# Altium schematic sheet control.SchDoc
size A4; SheetNumber: 1; SheetTotal: 3
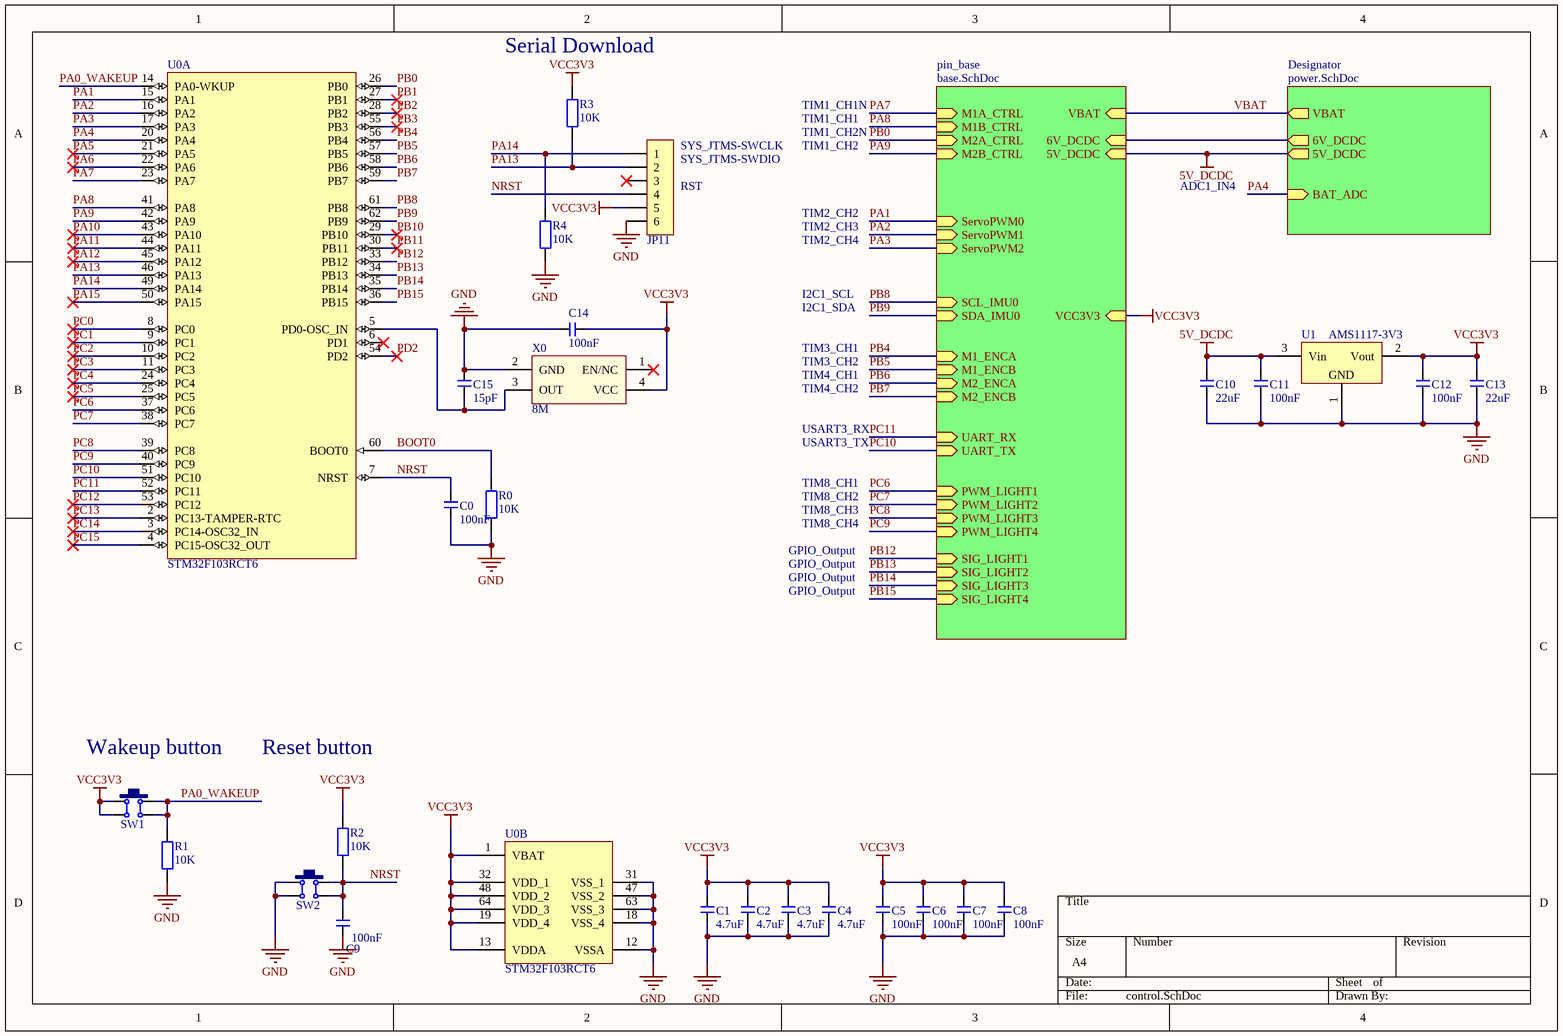
[diagram p0: control.SchDoc]

## Parts
C0  100nF  [C 0402_M]
C1  4.7uF  [C 0603_M]
C2  4.7uF  [C 0603_M]
C3  4.7uF  [C 0603_M]
C4  4.7uF  [C 0603_M]
C5  100nF  [C 0402_M]
C6  100nF  [C 0402_M]
C7  100nF  [C 0402_M]
C8  100nF  [C 0402_M]
C9  100nF  [C 0402_M]
C10  22uF  [C 1206_M]
C11  100nF  [C 0402_M]
C12  100nF  [C 0402_M]
C13  22uF  [C 1206_M]
C14  100nF  [C 0402_M]
C15  15pF  [C 0402_M]
JP11  HDR-1X6  [HDR2.54-WI-6P]  (value not drawn)
R0  10K  [R 0402_M]
R1  10K  [R 0402_M]
R2  10K  [R 0402_M]
R3  10K  [R 0402_M]
R4  10K  [R 0402_M]
SW1  6x6x5  [TSW SMD-6*6*4.3]  (value not drawn)
SW2  6x6x5  [TSW SMD-6*6*4.3]  (value not drawn)
U0  STM32F103RCT6  [LQFP64_M]  (parts A,B of 2)
U1  AMS1117-3V3  [SOT223_L]
X0  8M  [OSC 3225-4P]

## Sub-sheets
Designator = power.SchDoc: VBAT (out), 6V_DCDC (out), 5V_DCDC (out), BAT_ADC (in)
pin_base = base.SchDoc: M2B_CTRL (in), M2A_CTRL (in), M1B_CTRL (in), M1A_CTRL (in), VBAT (in), ServoPWM0 (in), ServoPWM1 (in), ServoPWM2 (in), SCL_IMU0 (in), SDA_IMU0 (in), M1_ENCB (in), M1_ENCA (in), M2_ENCA (in), M2_ENCB (in), 6V_DCDC (in), VCC3V3 (in), 5V_DCDC (in), UART_RX (in), UART_TX (in), PWM_LIGHT1 (in), PWM_LIGHT2 (in), PWM_LIGHT3 (in), PWM_LIGHT4 (in), SIG_LIGHT1 (in), SIG_LIGHT2 (in), SIG_LIGHT3 (in), SIG_LIGHT4 (in)

## Nets
5V_DCDC: C10.2 C11.2 U1.3(Vin) ; sheet pin_base/5V_DCDC, sheet Designator/5V_DCDC
GND: C0.1 C1.1 C2.1 C3.1 C4.1 C5.1 C6.1 C7.1 C8.1 C9.1 C10.1 C11.1 C12.1 C13.1 C14.2 C15.1 JP11.6 R0.1 R1.1 R4.1 SW2.1 SW2.4 U0.12(VSSA) U0.18(VSS_4) U0.31(VSS_1) U0.47(VSS_2) U0.63(VSS_3) U1.1(GND) X0.2(GND)
VCC3V3: C1.2 C2.2 C3.2 C4.2 C5.2 C6.2 C7.2 C8.2 C12.2 C13.2 C14.1 JP11.5 R2.2 R3.2 SW1.1 SW1.4 U0.1(VBAT) U0.13(VDDA) U0.19(VDD_4) U0.32(VDD_1) U0.48(VDD_2) U0.64(VDD_3) U1.2(Vout) X0.4(VCC) ; sheet pin_base/VCC3V3
BOOT0: R0.2 U0.60(BOOT0)
NRST: C0.2 C9.2 JP11.4 R2.1 SW2.2 SW2.3 U0.7(NRST)
PA0_WAKEUP: R1.2 SW1.2 SW1.3 U0.14(PA0-WKUP)
PA1: U0.15(PA1) ; sheet pin_base/ServoPWM0
PA2: U0.16(PA2) ; sheet pin_base/ServoPWM1
PA3: U0.17(PA3) ; sheet pin_base/ServoPWM2
PA4: U0.20(PA4) ; sheet Designator/BAT_ADC
PA5: U0.21(PA5)
PA6: U0.22(PA6)
PA7: U0.23(PA7) ; sheet pin_base/M1A_CTRL
PA8: U0.41(PA8) ; sheet pin_base/M1B_CTRL
PA9: U0.42(PA9) ; sheet pin_base/M2B_CTRL
PA10: U0.43(PA10)
PA11: U0.44(PA11)
PA12: U0.45(PA12)
PA13: JP11.2 R3.1 U0.46(PA13)
PA14: JP11.1 R4.2 U0.49(PA14)
PA15: U0.50(PA15)
PB0: U0.26(PB0) ; sheet pin_base/M2A_CTRL
PB1: U0.27(PB1)
PB2: U0.28(PB2)
PB3: U0.55(PB3)
PB4: U0.56(PB4) ; sheet pin_base/M1_ENCA
PB5: U0.57(PB5) ; sheet pin_base/M1_ENCB
PB6: U0.58(PB6) ; sheet pin_base/M2_ENCA
PB7: U0.59(PB7) ; sheet pin_base/M2_ENCB
PB8: U0.61(PB8) ; sheet pin_base/SCL_IMU0
PB9: U0.62(PB9) ; sheet pin_base/SDA_IMU0
PB10: U0.29(PB10)
PB11: U0.30(PB11)
PB12: U0.33(PB12) ; sheet pin_base/SIG_LIGHT1
PB13: U0.34(PB13) ; sheet pin_base/SIG_LIGHT2
PB14: U0.35(PB14) ; sheet pin_base/SIG_LIGHT3
PB15: U0.36(PB15) ; sheet pin_base/SIG_LIGHT4
PC0: U0.8(PC0)
PC1: U0.9(PC1)
PC2: U0.10(PC2)
PC3: U0.11(PC3)
PC4: U0.24(PC4)
PC5: U0.25(PC5)
PC6: U0.37(PC6) ; sheet pin_base/PWM_LIGHT1
PC7: U0.38(PC7) ; sheet pin_base/PWM_LIGHT2
PC8: U0.39(PC8) ; sheet pin_base/PWM_LIGHT3
PC9: U0.40(PC9) ; sheet pin_base/PWM_LIGHT4
PC10: U0.51(PC10) ; sheet pin_base/UART_TX
PC11: U0.52(PC11) ; sheet pin_base/UART_RX
PC12: U0.53(PC12)
PC13: U0.2(PC13-TAMPER-RTC)
PC14: U0.3(PC14-OSC32_IN)
PC15: U0.4(PC15-OSC32_OUT)
PD2: U0.54(PD2)
VBAT: sheet pin_base/VBAT, sheet Designator/VBAT
NetC15_2: C15.2 U0.5(PD0-OSC_IN) X0.3(OUT)
(unnamed): sheet pin_base/6V_DCDC, sheet Designator/6V_DCDC

Not connected (* = marked no-connect by the designer): JP11 3*; U0 6(PD1)*; X0 1(EN/NC)*

## Notes on the sheet
- (near R3) Serial Download
- TIM1_CH1N
- (near JP11) SYS_JTMS-SWDIO
- (near JP11) SYS_JTMS-SWCLK
- TIM1_CH1
- TIM1_CH2N
- TIM1_CH2
- (near JP11) RST
- TIM2_CH2
- TIM2_CH3
- TIM2_CH4
- ADC1_IN4
- I2C1_SCL
- I2C1_SDA
- TIM3_CH1
- TIM3_CH2
- TIM4_CH1
- TIM4_CH2
- USART3_RX
- USART3_TX
- TIM8_CH1
- TIM8_CH2
- TIM8_CH3
- GPIO_Output
- TIM8_CH4
- (near SW1) Wakeup button
- Reset button

## Library data of the parts
C0-C15 = C: 贴片电容
JP11 = Header 6: 6P接插件; 版权归属: 封装库来自淘宝 ID：黄晶宝石; BOM名称: 6P接插件; 学习资源: https://shop463601444.taobao.com
R0-R4 = R: 贴片电阻
SW1 SW2 = TSW SMD-6x6: 贴片6x6轻触开关
U0 = STM32F103RCT6: STM32 ARM-based 32-bit MCU Performance Line with 256 kB Flash, 48 kB Internal RAM, -40 to +85癈 Temperature, 64-Pin LQFP, Tray; DatasheetVersion: rev8.0, Apr-2011; PackageVersion: rev13, Apr-2011; PackageReference: LQFP64; PackageDescription: 64-Pin Low-Profile Quad Flat Pack, 10 x 10 mm Body, 0.5 mm Pitch (LQFP64); ComponentLink1Description: Manufacturer URL; ComponentLink1URL: http://www.st.com/; ComponentLink2Description: STM32F103 Datasheet; ComponentLink2URL: http://www.st.com/internet/com/TECHNICAL_RESOURCES/TECHNICAL_LITERATURE/DATASHEET/CD00191185.pdf; ComponentLink3Description: STM32 Family Web Page; ComponentLink3URL: www.st.com/stm32
U1 = AMS1117: 三端稳压芯片; BOM名称: 稳压芯片; 淘宝ID: 封装库来自淘宝 ID：黄晶宝石; 欢迎光临淘宝店铺: https://shop463601444.taobao.com
X0 = XTAL-ACT-4P: 4脚有源晶振